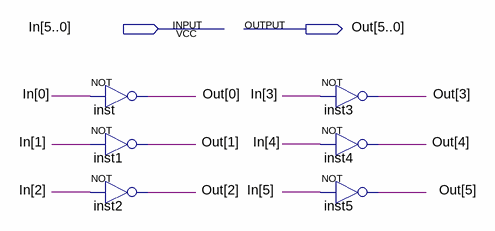
[diagram p0: schematic sheet]
// Quartus schematic gA6_not6.bdf as structural Verilog: 6 symbols, 2 pins
module gA6_not6 (
  input  [5:0] In,
  output [5:0] Out
);

  not inst (Out[0], In[0]);
  not inst1 (Out[1], In[1]);
  not inst2 (Out[2], In[2]);
  not inst3 (Out[3], In[3]);
  not inst4 (Out[4], In[4]);
  not inst5 (Out[5], In[5]);
endmodule
